# EAGLE design Game Controller Rev 1.2 (EAGLE 7.3.0)
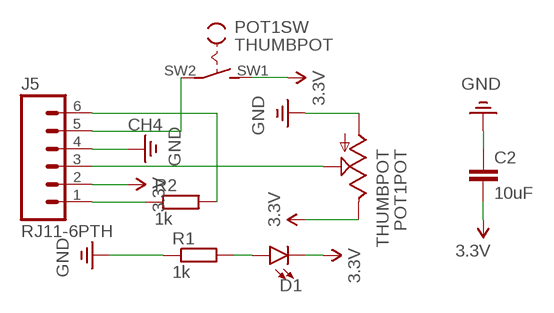
[diagram p0: schematic, sheet 1]

## Parts
C2  10uF  10UF-0805-10V-10%  [0805]
D1  LED-3MM-NO_SILK  [LED_3MM-NS]
J5  RJ11-6PTH  [RJ11-6]
POT1  THUMBPOT  [THUMBWHEEL]
R1  1k  R-EU_M0805  [M0805]
R2  1k  R-EU_M0805  [M0805]

## Nets
3.3V: C2.2 D1.K(C) J5.2 POT1.3(POT:E) POT1.SW1(SW:S)
CH4: J5.5 POT1.SW2(SW:P)
GND: C2.1 J5.4 POT1.1(POT:A) R1.1
N$1: D1.A R1.2
N$2: J5.3 POT1.2(POT:S)
N$16: J5.6 R2.2
N$17: J5.1 R2.1

## Library data of the parts
C2 = SparkFun-Capacitors:10UF: 10.0µF ceramic capacitors A capacitor is a passive two-terminal electrical component used to store electrical energy temporarily in an electric field.; PROD_ID: CAP-11330
D1 = SparkFun-LED:LED: LED (Generic) Standard schematic elements and footprints for 5mm, 3mm, 1206, and 0603 sized LEDs. Generic LEDs with no color specified.
J5 = SparkFun:RJ11-6: RJ11 Jack Simple 6 pin RJ11 jack. Commonly found on CAT3 devices and Microchip programmers. SKU: PRT-00132
POT1 = adafruit:THUMBPOT: Thumbwheel pot with switch Available in horizontal (Alpha RV121SF) or vertical (Xicon 311-1701)
R1 R2 = resistor:R-EU_: RESISTOR, European symbol

## Board
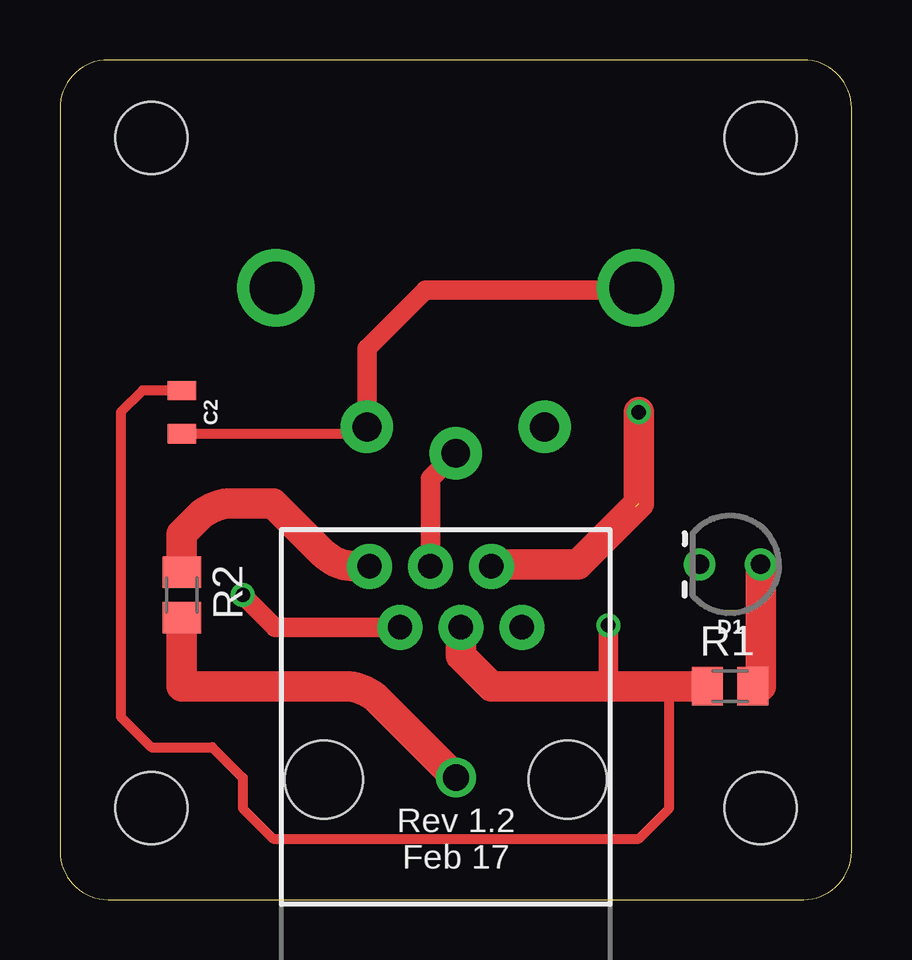
[diagram p1: board, top side]
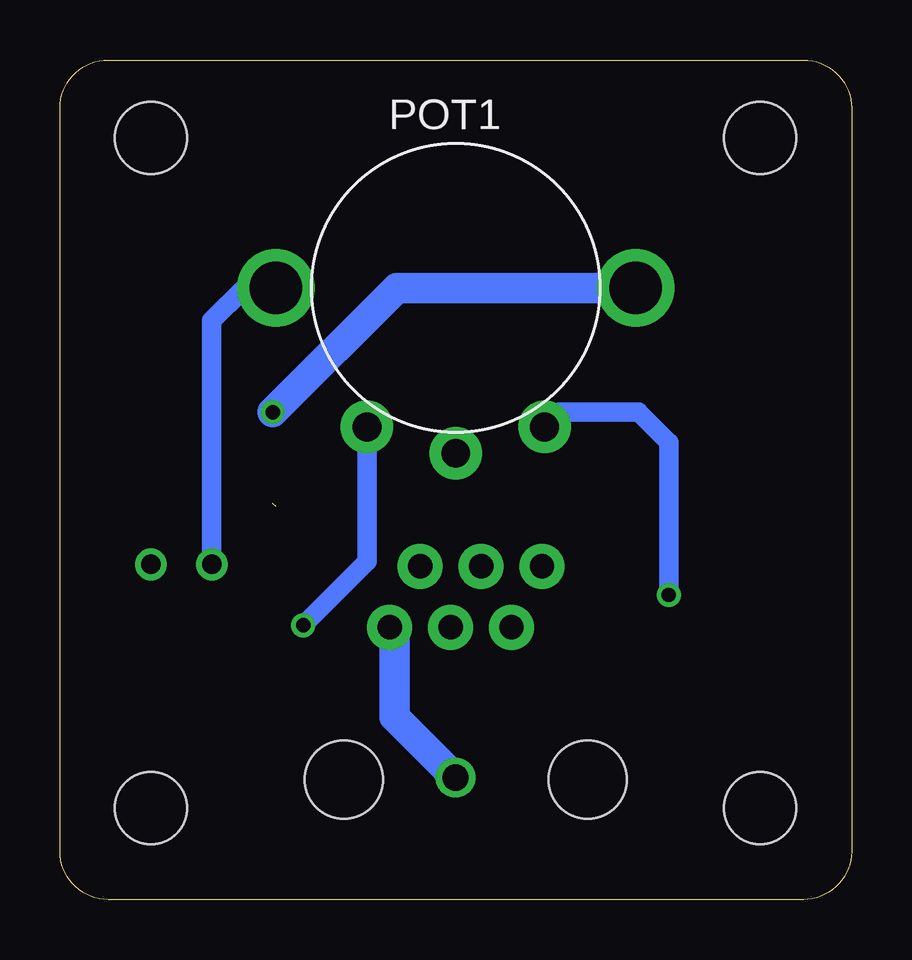
[diagram p2: board, bottom side, seen from below]

Size 33 x 35 mm. Coordinates in mm from the lower left corner, seen from the top.
Outline: 0,33 0,2 arc90 2,0 31,0 arc90 33,2 33,33 arc90 31,35 2,35 arc90 0,33
Copper layers (1*16): Top 0.035mm / dielectric 1.5mm / Bottom 0.035mm
Design rules "default": minimum track width 10mil, minimum drill 24mil, track to track 8mil, track to pad 8mil, pad to pad 8mil, via to via 8mil, smd to smd 8mil, copper to edge 40mil, drill to drill 8mil, minimum pad ring 10mil, minimum via ring 8mil, stop-mask expansion 4mil, vias tented up to drill 0mil, thermal gap 10mil
Holes 3 mm at 3.81,31.75 29.21,31.75 3.81,3.81 29.21,3.81

### Footprints (pad centres in the part's own frame; a part is rotated, then mirrored left to right if it is on the bottom)
0805 = smd 0.8 x 1.2: 1 -0.9,0; 2 0.9,0
LED_3MM-NS = drill 0.813: A -1.27,0; K 1.27,0
RJ11-6 = drill 1.016 pad 1.88: 1 1.905,8.89; 2 3.175,6.35; 3 4.445,8.89; 4 5.715,6.35; 5 6.985,8.89; 6 8.255,6.35 | hole 3.251: 0,0; 10.16,0
THUMBWHEEL = drill 1.2 pad 2.184: 1 -3.7,-5.8; 2 0,-6.9; 3 3.7,-5.8 | drill 2.2: SW1 -7.5,0; SW2 7.5,0
M0805 = smd 1.3 x 1.6: 1 -0.95,0; 2 0.95,0

### Placement (x,y rotation side)
C2  5.08,20.32 270 top
D1  27.94,13.97 180 top
J5  11,5 0 top
POT1  16.5,25.5 0 bottom
R1  27.94,8.89 0 top
R2  5.08,12.7 270 top

### Tracks (layer width: path | path; a pad name or v marks a point on that pad's centre or on a via)
3.3V  (via drill 0.6)
  Top 0.305: 23.9,25.4 POT1.SW1
  Top 0.406: C2.2 12.52,19.42 POT1.3
  Top 0.813: POT1.3 12.8,22.96 15.24,25.4 23.9,25.4 | J5.2 8.97,11.35 v7.62,12.7
  Bottom 0.813: POT1.SW1 25.3,25.5 26.67,24.13 D1.K | v7.62,12.7 7.62,19.05 8.89,20.32 12.18,20.32 POT1.3
CH4  (via drill 0.6)  (1 unrouted)
  Top 1.27: 24,16.38 21.59,13.97 18.07,13.97 J5.5 | v24.13,20.32 24.13,16.51
  Bottom 1.27: POT1.SW2 18.95,25.5 v24.13,20.32
GND  (via drill 0.6)
  Top 0.406: C2.1 3.44,21.22 2.54,20.32 2.54,7.62 3.81,6.35 6.35,6.35 7.62,5.08 7.62,3.81 8.89,2.54 24.13,2.54 25.4,3.81 25.4,8.89
  Top 0.813: v22.86,11.43 22.86,8.89
  Top 1.27: R1.1 25.4,8.89 22.86,8.89 17.98,8.89 16.71,10.16 J5.4
  Bottom 0.813: POT1.1 20.2,14.09 v22.86,11.43
N$1
  Top 1.27: D1.A 29.21,8.89 R1.2
N$2
  Top 0.813: J5.3 15.45,17.55 POT1.2
N$16  (via drill 1.1)
  Top 1.27: R2.2 5.08,8.89 11.87,8.89 arc-45 13.29,8.3 v16.51,5.08
  Bottom 1.27: v16.51,5.08 19.05,7.62 19.05,10.86 arc-45 J5.6
N$17
  Top 1.27: J5.1 12.34,13.89 arc-45 10.92,14.48 8.89,16.51 7.18,16.51 arc45 5.76,15.92 5.08,15.24 R2.1

### Text on the board
_tsilk: Rev 1.2 / Feb 17